# Altium schematic sheet OC_PROT.SchDoc
size C; SheetNumber: 2; SheetTotal: 5
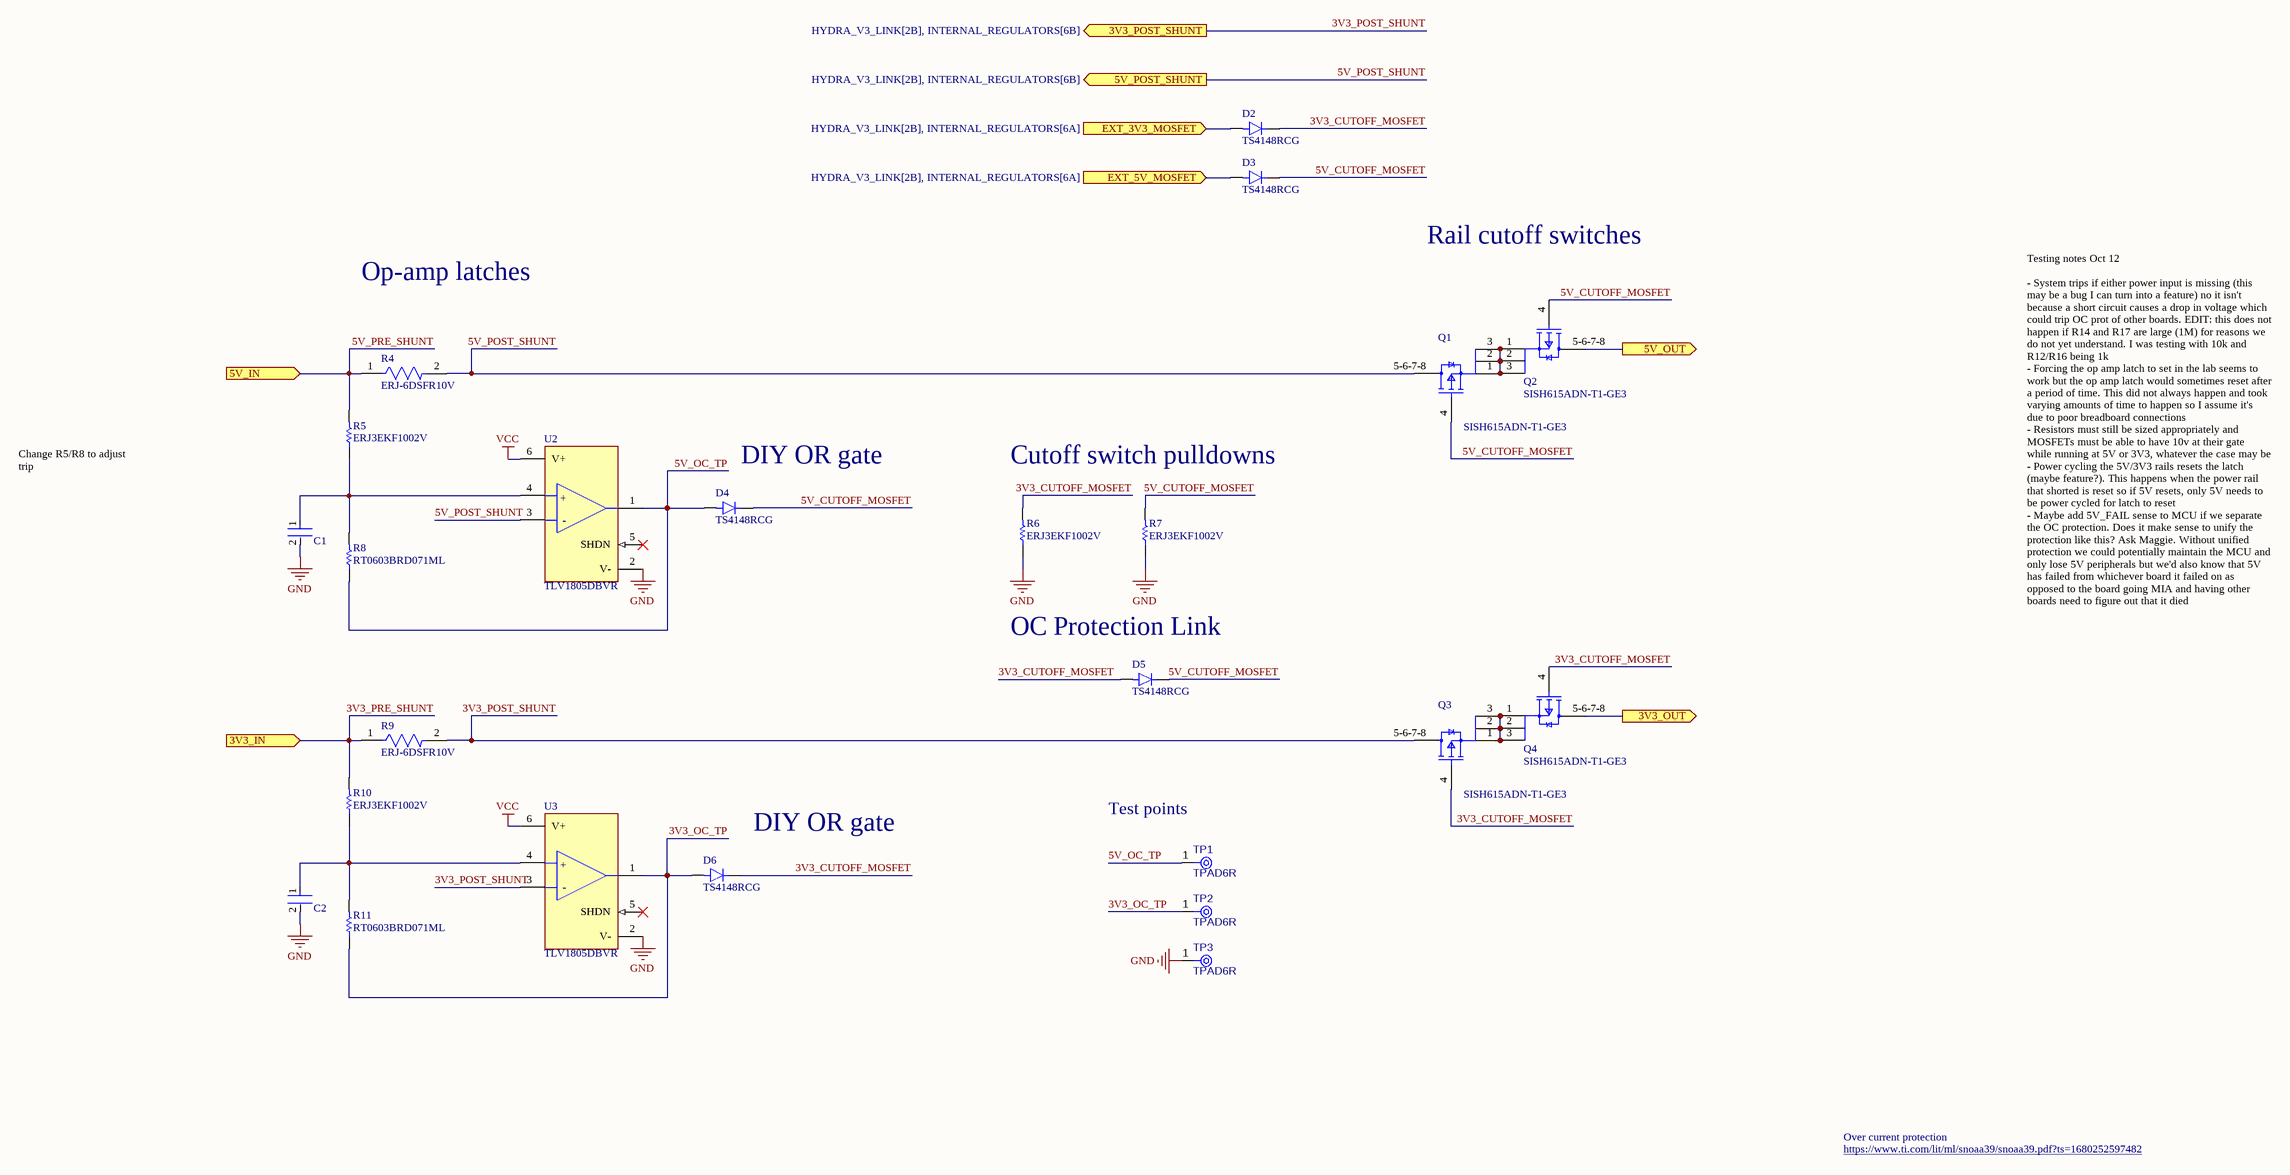
[diagram p0: OC_PROT.SchDoc]

## Parts
C1  C0402C104K8PACTU  [FP-C0402-BB-MFG]  (value not drawn)
C2  C0402C104K8PACTU  [FP-C0402-BB-MFG]  (value not drawn)
D2  TS4148RCG  [TS4148RCG-Footprint-1]
D3  TS4148RCG  [TS4148RCG-Footprint-1]
D4  TS4148RCG  [TS4148RCG-Footprint-1]
D5  TS4148RCG  [TS4148RCG-Footprint-1]
D6  TS4148RCG  [TS4148RCG-Footprint-1]
Q1  SISH615ADN-T1-GE3  [SISH615ADN-T1-GE3-Footprint-1]
Q2  SISH615ADN-T1-GE3  [SISH615ADN-T1-GE3-Footprint-1]
Q3  SISH615ADN-T1-GE3  [SISH615ADN-T1-GE3-Footprint-1]
Q4  SISH615ADN-T1-GE3  [SISH615ADN-T1-GE3-Footprint-1]
R4  ERJ-6DSFR10V  [FP-ERJ6D-MFG]
R5  ERJ3EKF1002V  [RESC1609X55X30LL15T15]
R6  ERJ3EKF1002V  [RESC1609X55X30LL15T15]
R7  ERJ3EKF1002V  [RESC1609X55X30LL15T15]
R8  RT0603BRD071ML  [RESC1608X55X30NL20T20]
R9  ERJ-6DSFR10V  [FP-ERJ6D-MFG]
R10  ERJ3EKF1002V  [RESC1609X55X30LL15T15]
R11  RT0603BRD071ML  [RESC1608X55X30NL20T20]
TP1  TPAD6R  [TP06R]  (no BOM)
TP2  TPAD6R  [TP06R]  (no BOM)
TP3  TPAD6R  [TP06R]  (no BOM)
U2  TLV1805DBVR  [FP-DBV0006A-IPC_C]
U3  TLV1805DBVR  [FP-DBV0006A-IPC_C]

## Ports
3V3_IN (in, see HYDRA_V3_LINK[2A]), 3V3_OUT (out, see HYDRA_V3_LINK[2B]), 3V3_POST_SHUNT (out, see HYDRA_V3_LINK[2B], INTERNAL_REGULATORS[6B]), 5V_IN (in, see HYDRA_V3_LINK[2A]), 5V_OUT (out, see HYDRA_V3_LINK[2B]), 5V_POST_SHUNT (out, see HYDRA_V3_LINK[2B], INTERNAL_REGULATORS[6B]), EXT_3V3_MOSFET (in, see HYDRA_V3_LINK[2B], INTERNAL_REGULATORS[6A]), EXT_5V_MOSFET (in, see HYDRA_V3_LINK[2B], INTERNAL_REGULATORS[6A])

## Nets
GND: C1.2 C2.2 R6.1 R7.1 TP3.1(TP) U2.2(V-) U3.2(V-)
VCC: U2.6(V+) U3.6(V+)
3V3_CUTOFF_MOSFET: D2.C(K) D5.A D6.C(K) Q3.4(G) Q4.4(G) R6.2
3V3_OC_TP: D6.A R11.1 TP2.1(TP) U3.1(OUT)
3V3_OUT: Q4.5-6-7-8(D) ; port 3V3_OUT
3V3_POST_SHUNT: Q3.5-6-7-8(D) R9.2 U3.3(-IN) ; port 3V3_POST_SHUNT
3V3_PRE_SHUNT: R9.1 R10.2 ; port 3V3_IN
5V_CUTOFF_MOSFET: D3.C(K) D4.C(K) D5.C(K) Q1.4(G) Q2.4(G) R7.2
5V_OC_TP: D4.A R8.1 TP1.1(TP) U2.1(OUT)
5V_OUT: Q2.5-6-7-8(D) ; port 5V_OUT
5V_POST_SHUNT: Q1.5-6-7-8(D) R4.2 U2.3(-IN) ; port 5V_POST_SHUNT
5V_PRE_SHUNT: R4.1 R5.2 ; port 5V_IN
EXT_3V3_MOSFET: D2.A ; port EXT_3V3_MOSFET
EXT_5V_MOSFET: D3.A ; port EXT_5V_MOSFET
NetC1_1: C1.1 R5.1 R8.2 U2.4(+IN)
NetC2_1: C2.1 R10.1 R11.2 U3.4(+IN)
NetQ1_1: Q1.1(S) Q1.2(S) Q1.3(S) Q2.1(S) Q2.2(S) Q2.3(S)
NetQ3_1: Q3.1(S) Q3.2(S) Q3.3(S) Q4.1(S) Q4.2(S) Q4.3(S)

Not connected (* = marked no-connect by the designer): U2 5(SHDN)*; U3 5(SHDN)*

## Notes on the sheet
- Rail cutoff switches
- Op-amp latches
- Type @ to refer to a designator
- (near D4) DIY OR gate
- Cutoff switch pulldowns
- Change R5/R8 to adjust trip
- (near D5) OC Protection Link
- Testing notes Oct 12
  - System trips if either power input is missing (this may be a bug I can turn into a feature) no it isn't because a short circuit causes a drop in voltage which could trip OC prot of other boards. EDIT: this does not happen if R14 and R17 are large (1M) for reasons we do not yet understand. I was testing with 10k and R12/R16 being 1k
  - Forcing the op amp latch to set in the lab seems to work but the op amp latch would sometimes reset after a period of time. This did not always happen and took varying amounts of time to happen so I assume it's due to poor breadboard connections
  - Resistors must still be sized appropriately and MOSFETs must be able to have 10v at their gate while running at 5V or 3V3, whatever the case may be
  - Power cycling the 5V/3V3 rails resets the latch (maybe feature?). This happens when the power rail that shorted is reset so if 5V resets, only 5V needs to be power cycled for latch to reset
  - Maybe add 5V_FAIL sense to MCU if we separate the OC protection. Does it make sense to unify the protection like this? Ask Maggie. Without unified protection we could potentially maintain the MCU and only lose 5V peripherals but we'd also know that 5V has failed from whichever board it failed on as opposed to the board going MIA and having other boards need to figure out that it died
- (near TP1) Test points
- (near D6) DIY OR gate
- https://www.ti.com/lit/ml/snoaa39/snoaa39.pdf?ts=1680252597482
- Over current protection
- (in symbol CMP-04896-000098-1) +; -

## Library data of the parts
C1 C2 = CMP-2008-02046-2: CAP CER 0.1UF 10V X5R 0402; Manufacturer: Kemet; Material: Ceramic; Capacitance: 0.10 μF; Temperature Coefficient: 15%; Tolerance: 0.1; Value: 0.10 μF; Package: C0402-BB; Temperature: -55°C to +125°C; ComponentLink2Description: Datasheet; Temperature Characteristic: X5R; Device Class L1: Passive Components; Height: 0.55mm; Lead Free: Yes; ComponentLink2URL: https://content.kemet.com/datasheets/KEM_C1002_X7R_SMD.pdf; Device Class L2: Capacitors; Temperature Range Low: -55°C; Temperature Range High: +125°C; RoHS: TRUE; Octopart: https://octopart.com/c0402c104k8pactu-kemet-140039; Automotive: No; Mouser Description: Capacitor 100 nF 10 VDC 0402; Category: Cap; Voltage Rating: 10 V; Digikey Description: CAP CER 0.1UF 10V X5R 0402; Ipc Land Pattern Name: CAPC10050X50; Device Class L3: Ceramic Capacitors; Manufacturer Part Number: C0402C104K8PACTU
D2-D6 = CMP-004-00036-1: SMD Si-Diode 75V 100mA 0603
Q1-Q4 = CMP-013-00036-1: Trans MOSFET P-CH 20V 22.1A 8-Pin PowerPAK 1212 EP T/R
R4 R9 = CMP-05422-000098-1: RES 0.1 OHM 1% 1/2W 0805; Temperature Coefficient: 150ppm/°C; Resistance: 100mR; Max Power Dissipation: 500mW; Tolerance: 1%; Length: 0.079inch; Features: Automotive AEC-Q200; Width: 0.049inch; Resistor Type: Thick Film; Case Code (Metric): 2012; Number of Terminations: 2; Max Operating Temperature: 155°C; Case/Package: 0805; Height: 0.028inch; Packaging: Cut Tape; Case Code (Imperial): 0805; Min Operating Temperature: -55°C
R5-R7 R10 = CMP-1012-00623-3: Chip Resistor, 10 KOhm, +/- 1%, 0.1 W, -55 to 155 degC, 0603 (1608 Metric), RoHS, Tape and Reel; Manufacturer: Panasonic; Voltage Rating: 75V; Case\/Package: 0603; Power Rating: 100mW; Resistance: 10KOhm; Temperature Coefficient: 100ppm\/degreesC; Number of Pins: 2; Package Reference: 603; Depth: 0.8mm; Mount: SurfaceMount; Package Description: 2-Pin Surface Mount Device, Body 1.6 x 0.85 mm; Datasheet Version: 02/2017; Length: 1.6mm; Lead Free: LeadFree; Height: 0.45mm; Number of Terminations: 2; Max Power Dissipation: 100mW; Min Operating Temperature: -55degC; Datasheet URL: https://industrial.panasonic.com/cdbs/www-data/pdf/RDA0000/AOA0000C304.pdf; Termination: SMD/SMT; Case Code (Metric): 1608; Case Code (Imperial): 0603; Tolerance: 1%; Max Operating Temperature: 155degC; RoHSCompliant: true; Voltage Rating (DC): 75V; Radiation Hardening: No; Packaging: TapeandReel; Composition: ThickFilm; Mounting Technology: SurfaceMount; Manufacturer URL: http://www.panasonic.com/; Width: 0.031inch; REACH SVHC: NoSVHC; Contact Plating: Tin; Military Standard: Not; Package Quantity: 1
R8 R11 = CMP-2000-00925-1: NOT PANASONIC, THIS IS A 1M RESISTORhttps://www.yageo.com/upload/media/product/productsearch/datasheet/rchip/PYu-RT_1-to-0.01_RoHS_L_13.pdf; Part Number: ERA-3AEB163V; Manufacturer: Panasonic
TP1-TP3 = CMP-00028-00002-2: 0.6mm round; Pins: 1
U2 U3 = CMP-04896-000098-1: 40V, RAIL-TO-RAIL INPUT, PUSH-PU